# Altium schematic sheet ConectoresSalida.SchDoc
size 533 x 304 mm
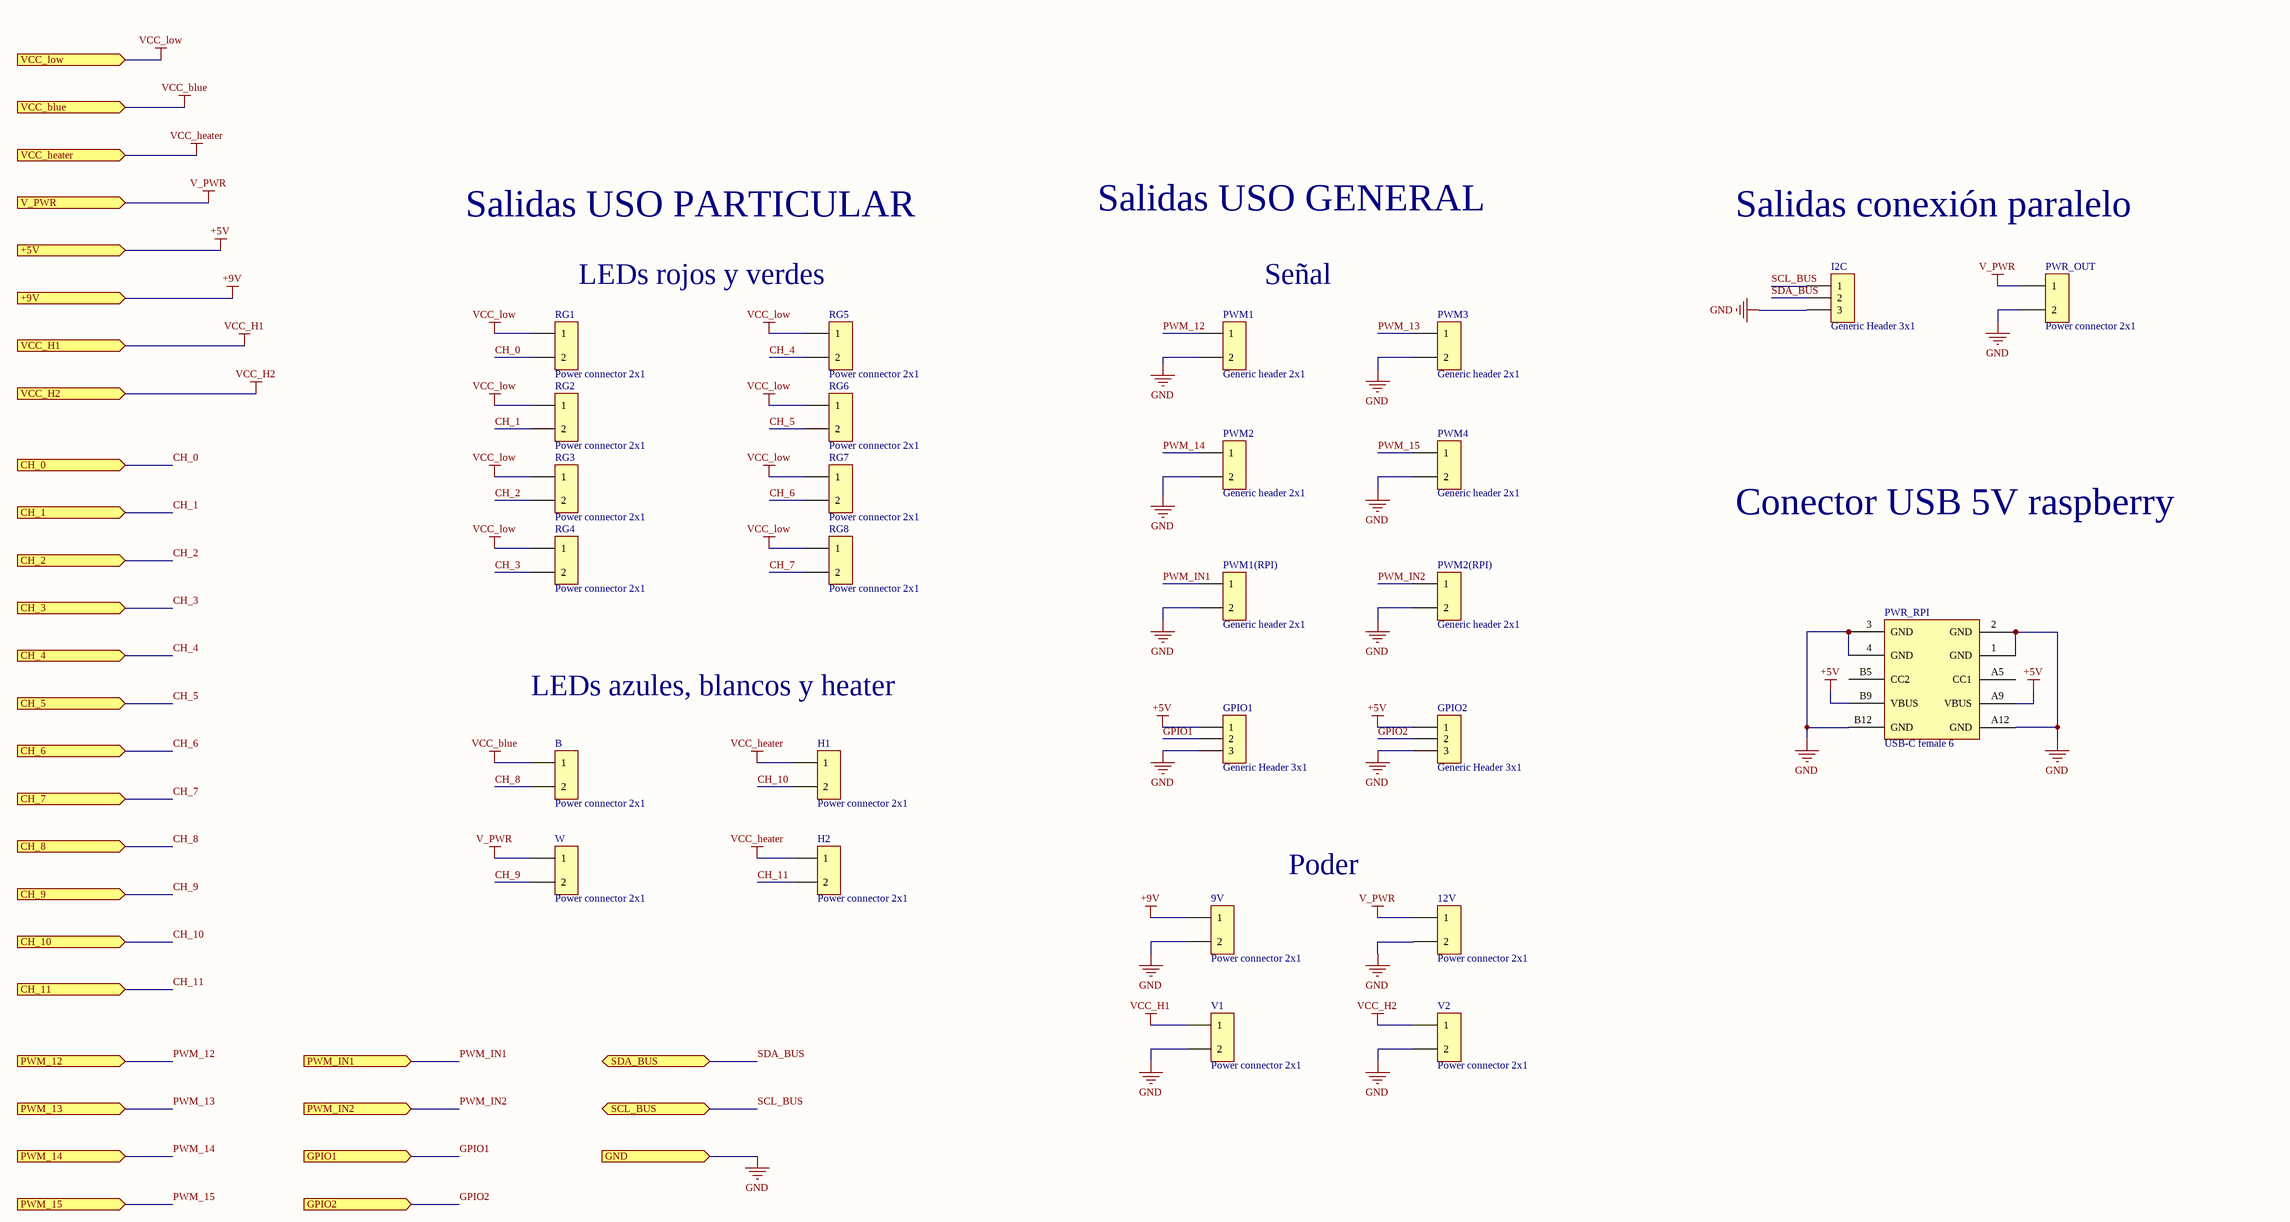
[diagram p0: ConectoresSalida.SchDoc]

## Parts
9V  Power connector 2x1  [CONN-TH_430450212]
12V  Power connector 2x1  [CONN-TH_430450212]
B  Power connector 2x1  [CONN-TH_430450212]
GPIO1  Generic Header 3x1  [CONN-TH_A2547WV-3P]
GPIO2  Generic Header 3x1  [CONN-TH_A2547WV-3P]
H1  Power connector 2x1  [CONN-TH_430450212]
H2  Power connector 2x1  [CONN-TH_430450212]
I2C  Generic Header 3x1  [CONN-TH_A2547WV-3P]
PWM1  Generic header 2x1  [CONN-TH_A2547WV-2P]
PWM1(RPI)  Generic header 2x1  [CONN-TH_A2547WV-2P]
PWM2  Generic header 2x1  [CONN-TH_A2547WV-2P]
PWM2(RPI)  Generic header 2x1  [CONN-TH_A2547WV-2P]
PWM3  Generic header 2x1  [CONN-TH_A2547WV-2P]
PWM4  Generic header 2x1  [CONN-TH_A2547WV-2P]
PWR_OUT  Power connector 2x1  [CONN-TH_430450212]
PWR_RPI  USB-C female 6  [USB-C_SMD 6 contacts]
RG1  Power connector 2x1  [CONN-TH_430450212]
RG2  Power connector 2x1  [CONN-TH_430450212]
RG3  Power connector 2x1  [CONN-TH_430450212]
RG4  Power connector 2x1  [CONN-TH_430450212]
RG5  Power connector 2x1  [CONN-TH_430450212]
RG6  Power connector 2x1  [CONN-TH_430450212]
RG7  Power connector 2x1  [CONN-TH_430450212]
RG8  Power connector 2x1  [CONN-TH_430450212]
V1  Power connector 2x1  [CONN-TH_430450212]
V2  Power connector 2x1  [CONN-TH_430450212]
W  Power connector 2x1  [CONN-TH_430450212]

## Ports
+5V (in), +9V (in), CH_0 (in), CH_1 (in), CH_2 (in), CH_3 (in), CH_4 (in), CH_5 (in), CH_6 (in), CH_7 (in), CH_8 (in), CH_9 (in), CH_10 (in), CH_11 (in), GND (in), GPIO1 (in), GPIO2 (in), PWM_12 (in), PWM_13 (in), PWM_14 (in), PWM_15 (in), PWM_IN1 (in), PWM_IN2 (in), SCL_BUS (bidir), SDA_BUS (bidir), V_PWR (in), VCC_blue (in), VCC_H1 (in), VCC_H2 (in), VCC_heater (in), VCC_low (in)

## Nets
+5V: GPIO1.1 GPIO2.1 PWR_RPI.A9(VBUS) PWR_RPI.B9(VBUS) ; port +5V
+9V: 9V.1 ; port +9V
GND: 9V.2 12V.2 GPIO1.3 GPIO2.3 I2C.3 PWM1.2 PWM1(RPI).2 PWM2.2 PWM2(RPI).2 PWM3.2 PWM4.2 PWR_OUT.2 PWR_RPI.1(GND) PWR_RPI.2(GND) PWR_RPI.3(GND) PWR_RPI.4(GND) PWR_RPI.A12(GND) PWR_RPI.B12(GND) V1.2 V2.2 ; port GND
V_PWR: 12V.1 PWR_OUT.1 W.1 ; port V_PWR
VCC_blue: B.1 ; port VCC_blue
VCC_H1: V1.1 ; port VCC_H1
VCC_H2: V2.1 ; port VCC_H2
VCC_heater: H1.1 H2.1 ; port VCC_heater
VCC_low: RG1.1 RG2.1 RG3.1 RG4.1 RG5.1 RG6.1 RG7.1 RG8.1 ; port VCC_low
CH_0: RG1.2 ; port CH_0
CH_1: RG2.2 ; port CH_1
CH_2: RG3.2 ; port CH_2
CH_3: RG4.2 ; port CH_3
CH_4: RG5.2 ; port CH_4
CH_5: RG6.2 ; port CH_5
CH_6: RG7.2 ; port CH_6
CH_7: RG8.2 ; port CH_7
CH_8: B.2 ; port CH_8
CH_9: W.2 ; port CH_9
CH_10: H1.2 ; port CH_10
CH_11: H2.2 ; port CH_11
GPIO1: GPIO1.2 ; port GPIO1
GPIO2: GPIO2.2 ; port GPIO2
PWM_12: PWM1.1 ; port PWM_12
PWM_13: PWM3.1 ; port PWM_13
PWM_14: PWM2.1 ; port PWM_14
PWM_15: PWM4.1 ; port PWM_15
PWM_IN1: PWM1(RPI).1 ; port PWM_IN1
PWM_IN2: PWM2(RPI).1 ; port PWM_IN2
SCL_BUS: I2C.1 ; port SCL_BUS
SDA_BUS: I2C.2 ; port SDA_BUS

Not connected (* = marked no-connect by the designer): PWR_RPI A5(CC1) B5(CC2)

## Notes on the sheet
- Salidas USO PARTICULAR
- Salidas USO GENERAL
- Salidas conexión paralelo
- LEDs rojos y verdes
- Señal
- Conector USB 5V raspberry
- LEDs azules, blancos y heater
- Poder

## Library data of the parts
9V 12V B H1 H2 PWR_OUT RG1-RG8 V1 V2 W = PC - 2X1: Generic Header Power 2pos; Manufacturer: MOLEX; Manufacturer Part Number: 430450212; Supplier 1: LCSC; Supplier Part Number 1: C293362; Package: *
GPIO1 GPIO2 I2C = Header - 3x1: Generic Header 3pos, 1 row, 2.54 pitch; Manufacturer: CJT(Changjiang Connectors); Manufacturer Part Number: A2547WV-3P; Pitch: 2.54; Supplier 1: LCSC; Supplier Part Number 1: C239378; Package: Through Hole,P=2.54mm
PWM1 PWM1(RPI) PWM2 PWM2(RPI) PWM3 PWM4 = Header - 2x1: Generic Header 2pos, 1 row, 2.54 pitch; Manufacturer: CJT(Changjiang Connectors); Manufacturer Part Number: A2547WV-2P; Pitch: 2.54mm; Supplier 1: LCSC; Supplier Part Number 1: C239377; Package: Through Hole,P=2.54mm
PWR_RPI = USB-C female 6: USB - Type C Female 6 USB Connectors RoHS; Manufacturer: Korean Hroparts Elec; Manufacturer Part Number: TYPE-C-31-M-17; Supplier 1: LCSC; Supplier Part Number 1: C283540